# EAGLE design crudblocks_solenoid (EAGLE 5.07)
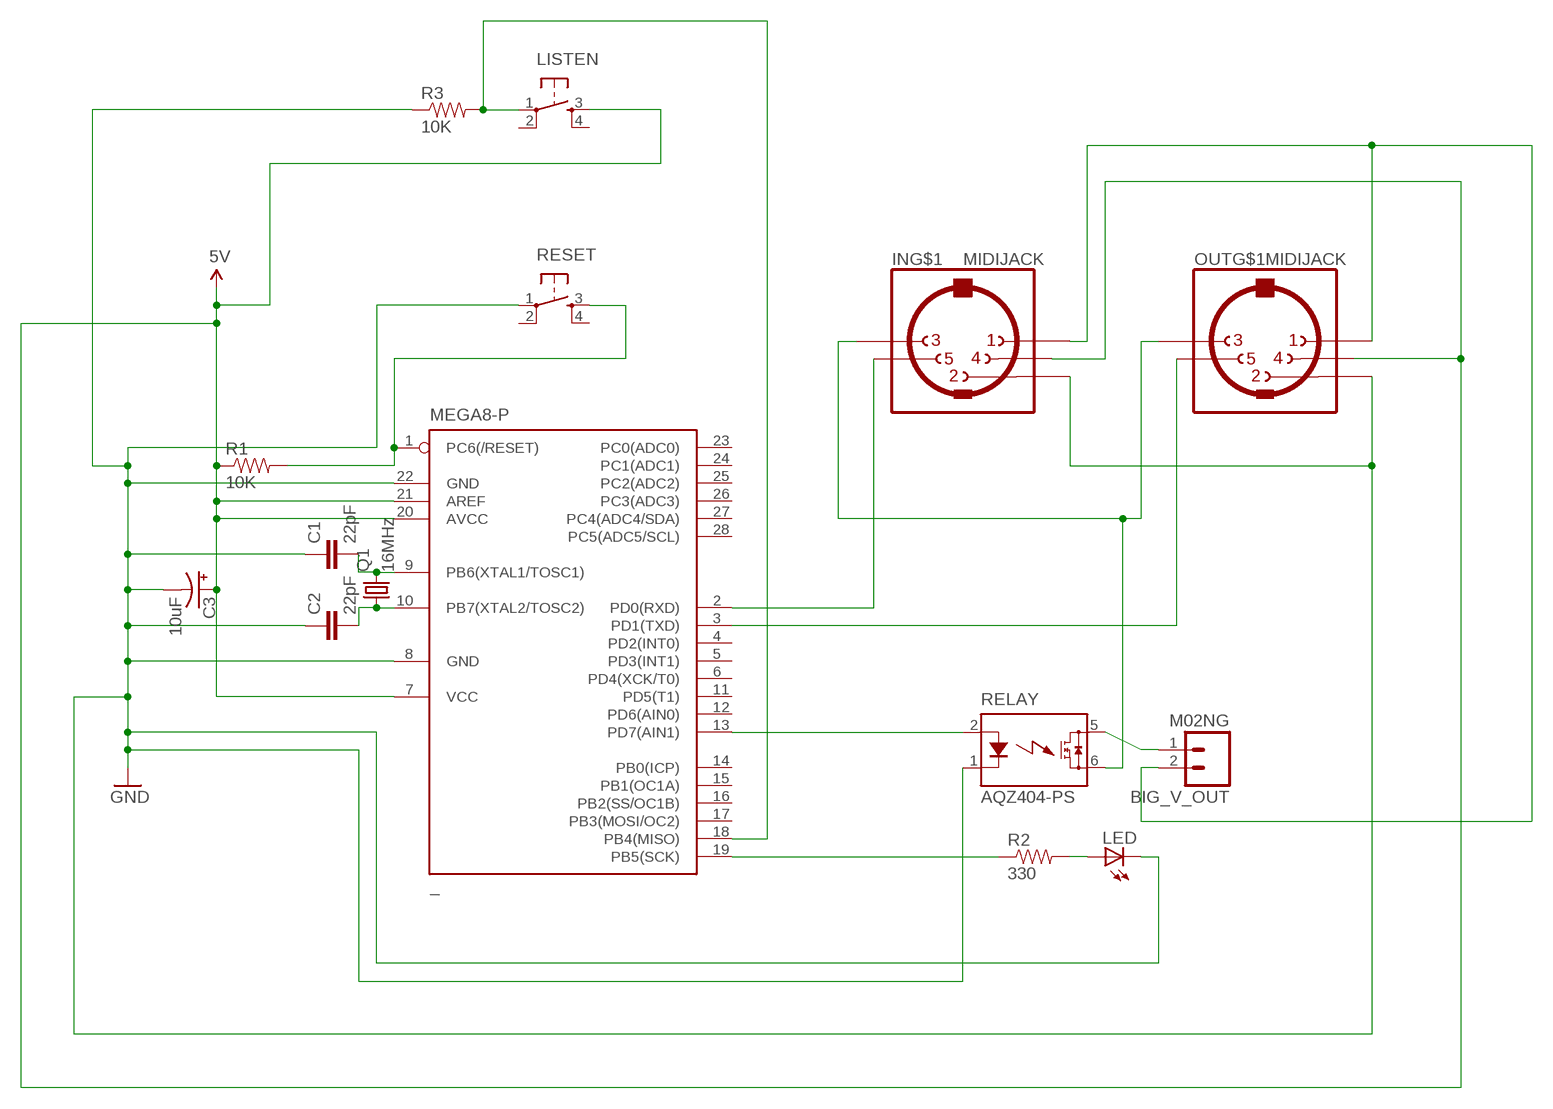
[diagram p0: schematic, sheet 1]

## Parts
_  MEGA8-P  [DIL28-3]
BIG_V_OUT  M02NG  [1X02]
C1  22pF  CAPPTH  [CAP-PTH-SMALL]
C2  22pF  CAPPTH  [CAP-PTH-SMALL]
C3  10uF  CAP_POLPTH2  [CPOL-RADIAL-10UF-25V]
IN  MIDIJACK  [CP-2350]
LED  LED5MM  [LED5MM]
LISTEN  TAC_SWITCHPTH  [TACTILE-PTH]
OUT  MIDIJACK  [CP-2350]
Q1  16MHz  CRYSTALHC49U-V  [HC49U-V]
R1  10K  RESISTORPTH-1/6W  [1/6W-RES]
R2  330  RESISTORPTH-1/6W  [1/6W-RES]
R3  10K  RESISTORPTH-1/6W  [1/6W-RES]
RELAY  AQZ404-PS  [AQZ404-PS]
RESET  TAC_SWITCHPTH  [TACTILE-PTH]

## Nets
5V: _.7(VCC) _.20(AVCC) _.21(AREF) C3.1(+) IN.4 LISTEN.3 OUT.4 R1.1
_: IN.3 OUT.3 RELAY.6(DS2)
GND: _.8(GND) _.22(GND) C1.1 C2.1 C3.2(-) IN.2 LED.K(C) OUT.2 R3.1 RELAY.1(K) RESET.1
N$1: _.1(PC6(/RESET)) R1.2 RESET.3
N$2: _.9(PB6(XTAL1/TOSC1)) C1.2 Q1.2
N$3: _.10(PB7(XTAL2/TOSC2)) C2.2 Q1.1
N$4: _.13(PD7(AIN1)) RELAY.2(A)
N$5: _.2(PD0(RXD)) IN.5
N$6: _.3(PD1(TXD)) OUT.5
N$8: BIG_V_OUT.2 IN.1 OUT.1
N$12: _.19(PB5(SCK)) R2.1
N$13: LED.A R2.2
N$14: BIG_V_OUT.1 RELAY.5(DS1)
N$15: _.18(PB4(MISO)) LISTEN.1 R3.2
Unconnected: _.4(PD2(INT0)) _.5(PD3(INT1)) _.6(PD4(XCK/T0)) _.11(PD5(T1)) _.12(PD6(AIN0)) _.14(PB0(ICP)) _.15(PB1(OC1A)) _.16(PB2(SS/OC1B)) _.17(PB3(MOSI/OC2)) _.23(PC0(ADC0)) _.24(PC1(ADC1)) _.25(PC2(ADC2)) _.26(PC3(ADC3)) _.27(PC4(ADC4/SDA)) _.28(PC5(ADC5/SCL)) IN.PE1(MT) IN.PE2(MT) IN.PE(MT) IN.PE@(MT) LISTEN.2 LISTEN.4 OUT.PE1(MT) OUT.PE2(MT) OUT.PE(MT) OUT.PE@(MT) RESET.2 RESET.4

## Library data of the parts
_ = atmel:MEGA8-P: MICROCONTROLLER 8 Kbytes FLASH, 1 kbytes SRAM, 512 bytes EEPROM, USART, 4-channel 10 bit ADC, 2-channel 8 bit ADC Pin compatible with Atmega48, ATMega88, ATMega168 Source: avr.lbr
BIG_V_OUT = SparkFun:M02NG
C1 C2 = SparkFun:CAP: Capacitor Standard 0603 ceramic capacitor, and 0.1" leaded capacitor.
C3 = SparkFun:CAP_POL: Capacitor Polarized These are standard SMD and PTH capacitors. Normally 10uF, 47uF, and 100uF in electrolytic and tantalum varieties. Always verify the external diameter of the through hole cap, it varies with capacity, voltage, and manufacturer. The EIA devices should be standard.
IN OUT = adafruit:MIDIJACK: DIN 5 jack also known as MIDI jack A modification of conn-hirshman:MAB5SH with two options for the grounding 'teeth'
LED = adafruit:LED: LED OSRAM: - CHIPLED LG R971, LG N971, LY N971, LG Q971, LY Q971, LO R971, LY R971 LH N974, LH R974 LS Q976, LO Q976, LY Q976 LO Q996 - Hyper CHIPLED LW Q18S LB Q993, LB Q99A, LB R99A - SideLED LS A670, LO A670, LY A670, LG A670, LP A670 LB A673, LV A673, LT A673, LW A673 LH A674 LY A675 LS A676, LA A676, LO A676, LY A676, LW A676 LS A679, LY A679, LG A679 - Hyper Micro SIDELED® LS Y876, LA Y876, LO Y876, LY Y876 LT Y87S - SmartLED LW L88C, LW L88S LB L89C, LB L89S, LG L890 LS L89K, LO L89K, LY L89K LS L896, LA L896, LO L896, LY L896 - TOPLED LS T670, LO T670, LY T670, LG T670, LP T670 LSG T670, LSP T670, LSY T670, LOP T670, LYG T670 LG T671, LOG T671, LSG T671 LB T673, LV T673, LT T673, LW T673 LH T674 LS T676, LA T676, LO T676, LY T676, LB T676, LH T676, LSB T676, LW T676 LB T67C, LV T67C, LT T67C, LS T67K, LO T67K, LY T67K, LW E67C LS E67B, LA E67B, LO E67B, LY E67B, LB E67C, LV E67C, LT E67C LW T67C LS T679, LY T679, LG T679 LS T770, LO T770, LY T770, LG T770, LP T770 LB T773, LV T773, LT T773, LW T773 LH T774 LS E675, LA E675, LY E675, LS T675 LS T776, LA T776, LO T776, LY T776, LB T776 LHGB T686 LT T68C, LB T68C - Hyper Mini TOPLED® LB M676 - Mini TOPLED Santana® LG M470 LS M47K, LO M47K, LY M47K Source: http://www.osram.convergy.de/
LISTEN RESET = SparkFun:TAC_SWITCH: Momentary Switch Button commonly used for reset or general input. Spark Fun Electronics SKU : COM-00097
Q1 = crystal:CRYSTAL: CRYSTAL
R1-R3 = SparkFun:RESISTOR: Resistor Basic schematic elements and footprints for 0603, 1206, and PTH resistors.
RELAY = relay:AQZ*: Power PhotoMOS Relay NAiS Source: http://www.mew-europe.com/.. pti_en.pdf

## Board
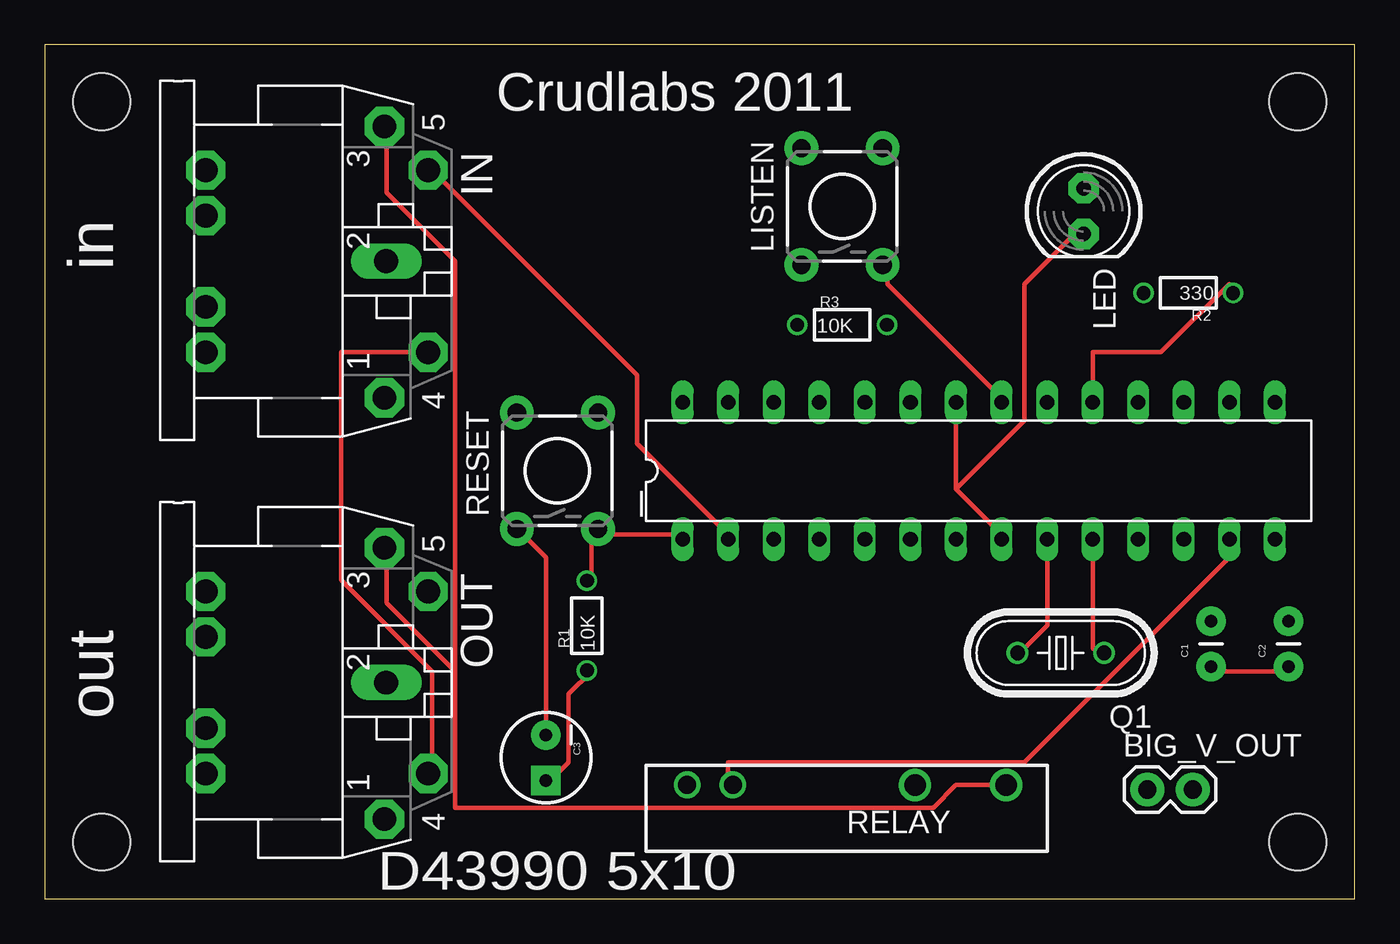
[diagram p1: board, top side]
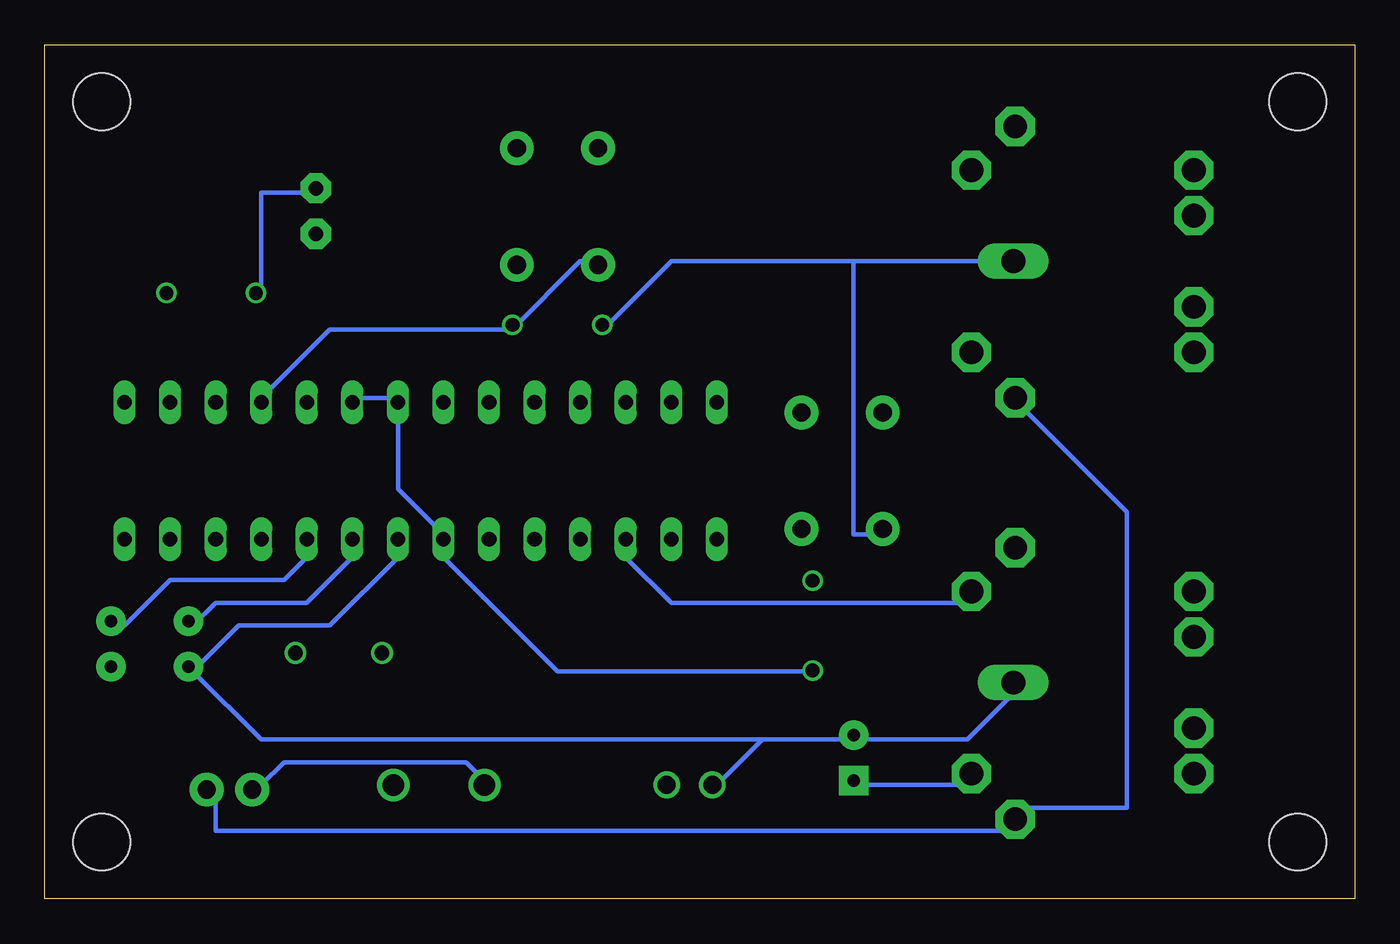
[diagram p2: board, bottom side, seen from below]

Size 73.03 x 47.62 mm. Coordinates in mm from the lower left corner, seen from the top.
Outline: 0,0 73.03,0 73.03,47.62 0,47.62 0,0
Copper layers (1*16): Top 0.0356mm / dielectric 1.5011mm / Bottom 0.0356mm
Design rules "LaenPCBOrder": minimum track width 6mil, minimum drill 13mil, track to track 6mil, track to pad 6mil, pad to pad 6mil, via to via 6mil, smd to smd 6mil, copper to edge 15mil, drill to drill 6mil, minimum pad ring 7mil, minimum via ring 7mil, stop-mask expansion 4mil, vias tented up to drill 0mil, thermal gap 10mil
Holes 3.17 mm at 3.17,44.45 69.85,44.45 69.85,3.17 3.17,3.17

### Footprints (pad centres in the part's own frame; a part is rotated, then mirrored left to right if it is on the bottom)
DIL28-3 = drill 0.813 long: 1 -16.51,-3.81; 2 -13.97,-3.81; 3 -11.43,-3.81; 4 -8.89,-3.81; 5 -6.35,-3.81; 6 -3.81,-3.81; 7 -1.27,-3.81; 8 1.27,-3.81; 9 3.81,-3.81; 10 6.35,-3.81; 11 8.89,-3.81; 12 11.43,-3.81; 13 13.97,-3.81; 14 16.51,-3.81; 15 16.51,3.81; 16 13.97,3.81; 17 11.43,3.81; 18 8.89,3.81; 19 6.35,3.81; 20 3.81,3.81; 21 1.27,3.81; 22 -1.27,3.81; 23 -3.81,3.81; 24 -6.35,3.81; 25 -8.89,3.81; 26 -11.43,3.81; 27 -13.97,3.81; 28 -16.51,3.81
1X02 = drill 1.016 pad 1.88 round: 1 0,0; 2 2.54,0
CAP-PTH-SMALL = drill 0.7 pad 1.651 round: 1 0,0; 2 2.54,0
CPOL-RADIAL-10UF-25V = drill 0.7 pad 1.651 square: 1 1.27,0 | drill 0.7 pad 1.651 round: 2 -1.27,0
CP-2350 = drill 1.321 pad 2.184 octagon: 1 7.62,12.58; 3 -7.52,12.58; 4 5.08,15.02; 5 -5.08,15.02; PE -2.54,2.62; PE1 -5.08,2.62; PE2 5.08,2.62; PE@ 2.54,2.62 | drill 1.321 long: 2 0,12.68
LED5MM = drill 0.813 pad 1.676 octagon: A -1.27,0; K 1.27,0
TACTILE-PTH = drill 1.016 pad 1.88 round: 1 -3.251,2.261; 2 3.251,2.261; 3 -3.251,-2.261; 4 3.251,-2.261
HC49U-V = drill 0.813 round: 1 -2.413,0; 2 2.413,0
1/6W-RES = drill 0.762 round: 1 -2.5,0; 2 2.5,0
AQZ404-PS = drill 1 round: 1 -8.89,0; 2 -6.35,0 | drill 1.2 round: 5 3.81,0; 6 8.89,0

### Placement (x,y rotation side)
_  52.07,23.88 0 top
BIG_V_OUT  61.47,6.1 0 top
C1  65.02,12.95 90 top
C2  69.34,12.95 90 top
C3  27.94,7.87 270 top
IN  6.35,35.56 270 top
LED  57.91,38.35 270 top
LISTEN  44.45,38.61 90 top
OUT  6.35,12.06 270 top
Q1  56.64,13.72 180 top
R1  30.23,15.24 90 top
R2  63.75,33.78 180 top
R3  44.45,32 0 top
RELAY  44.7,6.35 0 top
RESET  28.57,23.88 90 top
U$2  [CRUDLABS_LOGO_1]  32.77,39.12 0 top

### Tracks (layer width: path | path; a pad name or v marks a point on that pad's centre or on a via)
5V
  Top 0.254: _.21 53.34,27.94 46.99,34.29 46.99,35.56 LISTEN.3 | R1.1 30.48,12.7 29.21,11.43 29.21,7.62 27.94,6.35 C3.1 | IN.4 16.51,30.48 16.51,17.78 21.59,12.7 21.59,7.62 OUT.4
  Bottom 0.254: _.20 55.88,27.94 53.34,27.94 _.21 53.34,22.86 50.8,20.32 _.7 50.8,19.05 44.45,12.7 30.48,12.7 R1.1 | OUT.4 21.59,6.35 27.94,6.35 C3.1
_
  Top 0.254: 22.86,12.7 22.86,5.08 49.53,5.08 50.8,6.35 RELAY.6 | 22.86,12.7 19.05,16.51 19.05,19.05 OUT.3 | 22.86,12.7 22.86,35.56 19.05,39.37 19.05,43.18 IN.3
GND
  Top 0.254: C1.1 64.77,12.7 68.58,12.7 C2.1 | 50.8,22.86 53.34,20.32 _.8 | 50.8,22.86 _.22 | 50.8,22.86 54.61,26.67 54.61,34.29 57.15,36.83 LED.K | RESET.1 26.67,20.32 27.94,19.05 C3.2 27.94,8.89
  Bottom 0.254: 64.77,12.7 62.23,15.24 57.15,15.24 53.34,19.05 _.8 | 27.94,35.56 38.1,35.56 41.91,31.75 R3.1 | 27.94,35.56 IN.2 | 33.02,8.89 35.56,6.35 RELAY.1 | 27.94,8.89 33.02,8.89 | 27.94,8.89 21.59,8.89 19.05,11.43 OUT.2 | 27.94,8.89 C3.2 | 27.94,35.56 27.94,20.32 26.67,20.32 RESET.1 | 64.77,12.7 60.96,8.89 33.02,8.89 | 64.77,12.7 C1.1
N$1
  Top 0.254: R1.2 30.48,17.78 30.48,20.32 RESET.3 31.75,20.32 35.56,20.32 _.1
N$2
  Top 0.254: Q1.2 54.61,13.97 55.88,15.24 _.9
  Bottom 0.254: C1.2 64.77,15.24 63.5,16.51 58.42,16.51 55.88,19.05 _.9
N$3
  Top 0.254: Q1.1 58.42,13.97 _.10
  Bottom 0.254: C2.2 68.58,15.24 66.04,17.78 59.69,17.78 58.42,19.05 _.10
N$4
  Top 0.254: _.13 66.04,19.05 54.61,7.62 38.1,7.62 38.1,6.35 RELAY.2
N$5
  Top 0.254: _.2 38.1,20.32 33.02,25.4 33.02,29.21 21.59,40.64 IN.5
N$6
  Bottom 0.254: _.3 40.64,19.05 38.1,16.51 21.59,16.51 OUT.5
N$8
  Bottom 0.254: BIG_V_OUT.2 63.5,6.35 63.5,3.81 19.05,3.81 OUT.1 19.05,5.08 12.7,5.08 12.7,21.59 19.05,27.94 IN.1
N$12
  Top 0.254: R2.1 66.04,34.29 62.23,30.48 58.42,30.48 _.19
N$13
  Bottom 0.254: R2.2 60.96,34.29 60.96,39.37 58.42,39.37 LED.A
N$14
  Bottom 0.254: RELAY.5 48.26,6.35 49.53,7.62 59.69,7.62 60.96,6.35 BIG_V_OUT.1
N$15
  Bottom 0.254: 46.99,31.75 43.18,35.56 41.91,35.56 LISTEN.1 | 46.99,31.75 57.15,31.75 60.96,27.94 _.18 | 46.99,31.75 R3.2

### Text on the board
tPlace: Crudlabs 2011 | in | out | D43990 5x10